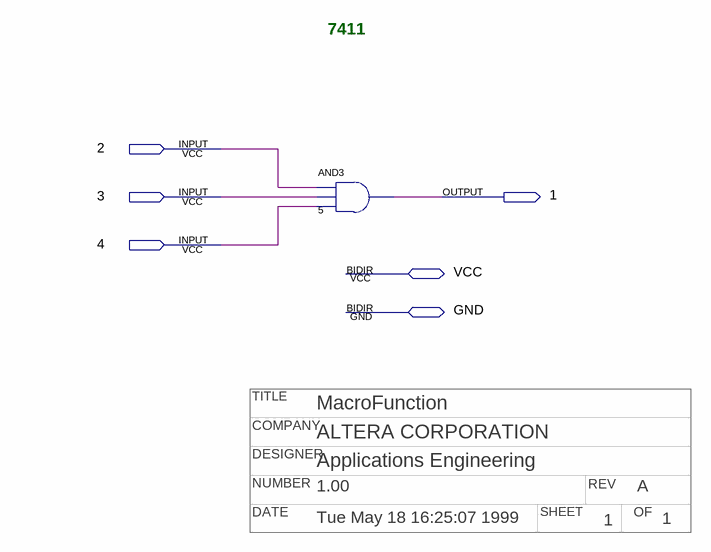
[diagram p0: schematic sheet]
// Quartus schematic np7411.bdf as structural Verilog: 1 symbols, 6 pins
// Title block: TITLE: MacroFunction; COMPANY: ALTERA CORPORATION; DESIGNER: Applications Engineering; NUMBER: 1.00; REV: A; DATE: Tue May 18 16:25:07 1999; SHEET: 1; OF: 1
module np7411 (
  input  \2 ,
  input  \3 ,
  input  \4 ,
  inout  VCC,
  inout  GND,
  output \1 
);

  and u_5 (\1 , \2 , \3 , \4 );

  // Notes on the sheet:
  //   7411
endmodule
